# Altium project 1.1 - SYNC_BUCK_IR2104_2021.7.31.PrjPcb
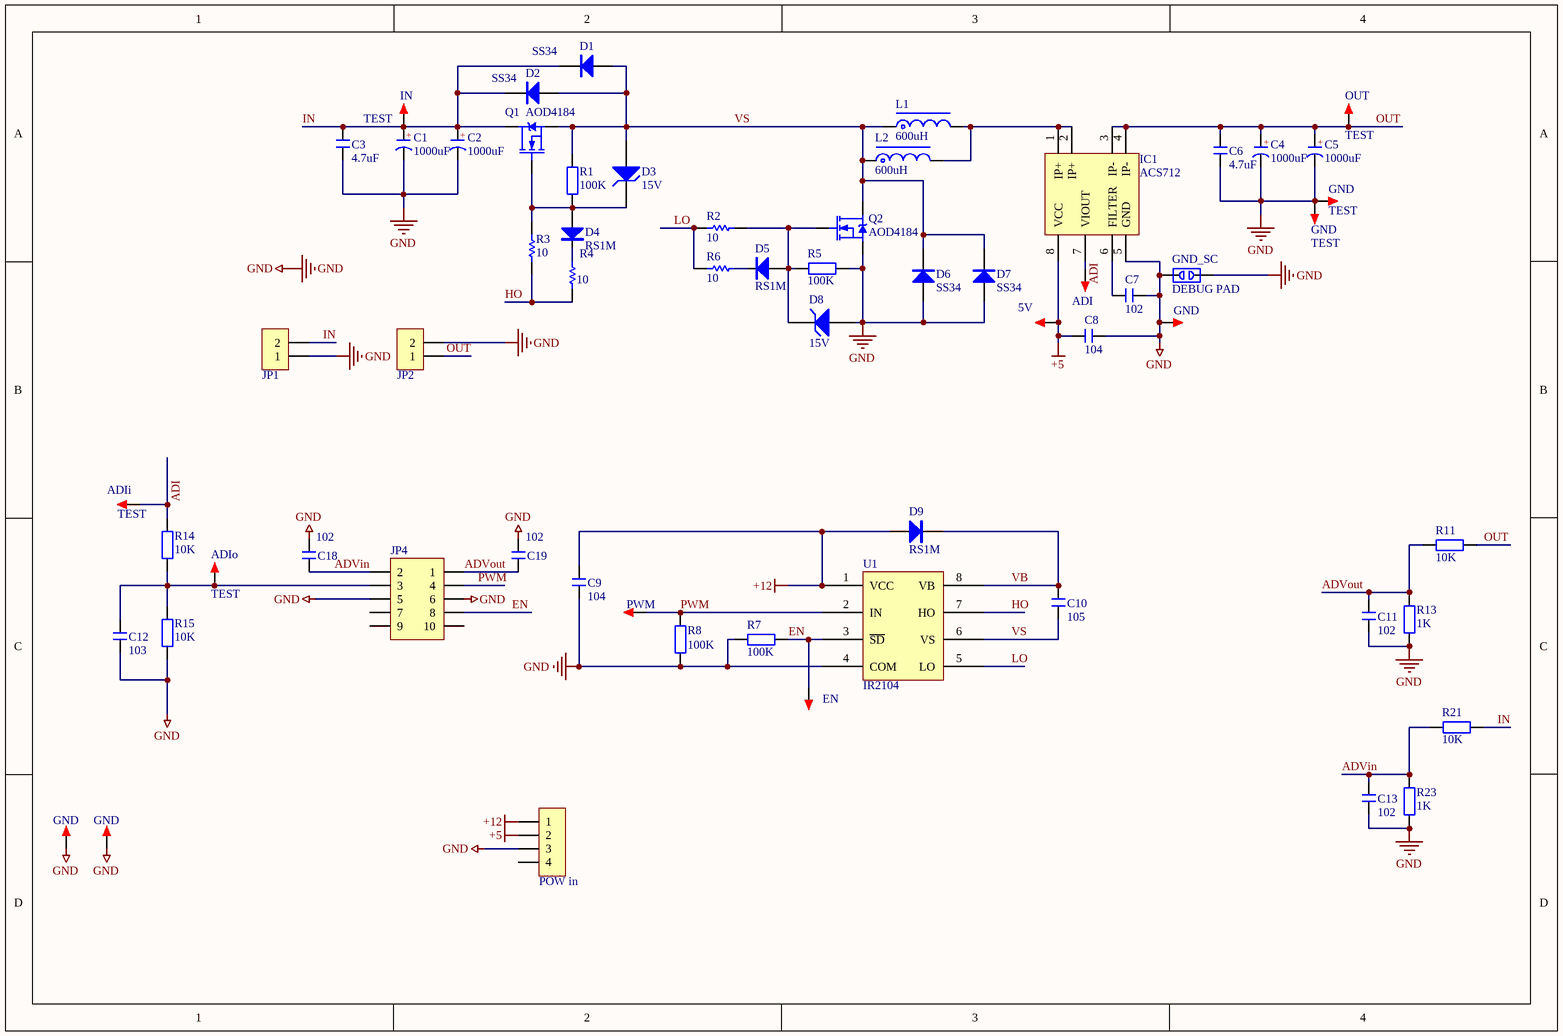
[diagram p0: IR2104_SYNC_BUCK.SchDoc]
1 sheet, 62 parts. Net scope: global (net labels, ports and power ports of the same name join across sheets).
Board file: IR2104_SYNC_BUCK.PcbDoc

## Sheet IR2104_SYNC_BUCK.SchDoc
size A4; Organization: Altium Limited; Address1: L3, 12a Rodborough Rd; Address2: Frenchs Forest; Address3: NSW; Address4: Australia 2086

### Parts
(Parts that share a designator on the sheet are numbered #1, #2 ... from top to bottom, then left to right.)
5V  TEST  [TEST 1.6]  (value not drawn)
ADI  TEST  [TEST 1.6]  (value not drawn)
ADIi  TEST  [TEST 1.6]
ADIo  TEST  [TEST 1.6]
C1  1000uF  [CAP 7.5*16*25]
C2  1000uF  [CAP 7.5*16*25]
C3  4.7uF  [CBB 25]
C4  1000uF  [CAP 7.5*16*25]
C5  1000uF  [CAP 7.5*16*25]
C6  4.7uF  [CBB 25]
C7  102  [C 0805_L]
C8  104  [C 0805_L]
C9  104  [C 0805_L]
C10  105  [C 0805_L]
C11  102  [C 0805_L]
C12  103  [C 0805_L]
C13  102  [C 0805_L]
C18  102  [C 0805_L]
C19  102  [C 0805_L]
D1  SS34  [SMC]
D2  SS34  [SMA]
D3  15V  [LL41]
D4  RS1M  [SMA]
D5  RS1M  [SMA]
D6  SS34  [SMA]
D7  SS34  [SMC]
D8  15V  [LL41]
D9  RS1M  [SMA]
EN  TEST  [TEST 1.2]  (value not drawn)
GND#1  TEST  [TEST 2.4]
GND#2  TEST  [TEST 2.4]
GND#3  TEST  [TEST 1.6]  (value not drawn)
GND#4  TEST TP  [TEST TP1.4_B]  (value not drawn)
GND#5  TEST TP  [TEST TP1.4_B]  (value not drawn)
GND_SC  DEBUG PAD  [DEBUG_B]
IC1  ACS712  [SOP8_N]
IN  TEST  [TEST 2.4]
JP1  HDR-1X2  [KF7620-2P]  (value not drawn)
JP2  HDR-1X2  [KF7620-2P]  (value not drawn)
JP4  Header 5X2  [IDC2.54-LI-2x5P]  (value not drawn)
L1  600uH  [CS400125]
L2  600uH  [CS270125]
OUT  TEST  [TEST 2.4]
POW_in  HDR-1X4  [KF2510-LI-4P]  (value not drawn)
PWM  TEST  [TEST 1.2]  (value not drawn)
Q1  AOD4184  [TO252]
Q2  AOD4184  [TO252]
R1  100K  [R 0805_L]
R2  10  [RS 1W-V5]
R3  10  [RS 1W-V5]
R4  10  [RS 1W-V5]
R5  100K  [R 0805_L]
R6  10  [RS 1W-V5]
R7  100K  [R 0805_L]
R8  100K  [R 0805_L]
R11  10K  [R 0805_L]
R13  1K  [R 0805_L]
R14  10K  [R 0805_L]
R15  10K  [R 0805_L]
R21  10K  [R 0805_L]
R23  1K  [R 0805_L]
U1  IR2104  [SOP8]

### Nets
+5: 5V.1 C8.2 IC1.8(VCC) POW_in.2
+12: C9.2 D9.1(A) POW_in.1 U1.1(VCC)
GND: C1.2(K) C2.2(K) C3.1 C4.2(K) C5.2(K) C6.1 C7.1 C8.1 C9.1 C11.1 C12.1 C13.1 C18.2 C19.2 D6.1(A) D7.1(A) D8.1(A) GND#1.1 GND#2.1 GND#3.1 GND#4.1 GND#5.1 GND_SC.1 GND_SC.2 IC1.5(GND) JP1.1 JP2.2 JP4.5 JP4.6 POW_in.3 Q2.3(S) R5.2 R7.2 R8.1 R13.1 R15.2 R23.1 U1.4(COM)
ADI: ADI.1 ADIi.1 IC1.7(VIOUT) R14.1
ADVin: C13.2 C18.1 JP4.2 R21.1 R23.2
ADVout: C11.2 C19.1 JP4.1 R11.1 R13.2
EN: EN.1 JP4.8 R7.1 U1.3(~{SD})
HO: R3.2 R4.1 U1.7(HO)
IN: C1.1(A) C2.1(A) C3.2 D1.2(K) D2.2(K) IN.1 JP1.2 Q1.2(D) R21.2
LO: R2.2 R6.1 U1.5(LO)
OUT: C4.1(A) C5.1(A) C6.2 IC1.3(IP-) IC1.4(IP-) JP2.1 OUT.1 R11.2
PWM: JP4.4 PWM.1 R8.2 U1.2(IN)
VB: C10.2 D9.2(K) U1.8(VB)
VS: C10.1 D1.1(A) D2.1(A) D3.1(A) D6.2(K) D7.2(K) L1.1 L2.1 Q1.3(S) Q2.2(D) R1.2 U1.6(VS)
NetADIo_1: ADIo.1 C12.2 JP4.3 R14.2 R15.1
NetC7_2: C7.2 IC1.6(FILTER)
NetD3_2: D3.2(K) D4.1(A) Q1.1(G) R1.1 R3.1
NetD4_2: D4.2(K) R4.2
NetD5_1: D5.1(A) D8.2(K) Q2.1(G) R2.1 R5.1
NetD5_2: D5.2(K) R6.2
NetIC1_1: IC1.1(IP+) IC1.2(IP+) L1.2 L2.2

Not connected (* = marked no-connect by the designer): JP4 7 9 10; POW_in 4

### Notes on the sheet
- Title
- Size:
- Date:
- A4
- Number:
- Time:
- Revision:
- Sheet
- of
- File:
- (in symbol CE) +

### Library data of the parts
5V ADI ADIi ADIo EN GND#1-GND#3 IN OUT PWM = TEST: 测试点; 淘宝ID: 小糖豆的小窝窝; BOM名称: 测试点; 下单链接: https://item.taobao.com/item.htm?ft=t&id=613637044352
C1 C2 C4 C5 = CE: 直插电解电容; 淘宝ID: 小糖豆的小窝窝; BOM名称: 直插电解电容; 下单链接: https://item.taobao.com/item.htm?ft=t&id=613637044352
C3 C6 = CBB: CBB电容; 淘宝ID: 小糖豆的小窝窝; BOM名称: CBB电容; 下单链接: https://item.taobao.com/item.htm?ft=t&id=613637044352
C7-C13 C18 C19 = C: 贴片电容; 淘宝ID: 小糖豆的小窝窝; BOM名称: 贴片电容; 下单链接: https://item.taobao.com/item.htm?ft=t&id=613637044352
D1 D2 D4-D7 D9 = 1N4007: 整流二极管; 淘宝ID: 小糖豆的小窝窝; BOM名称: 整流二极管; 下单链接: https://item.taobao.com/item.htm?ft=t&id=613637044352
D3 D8 = D Zener: Zener Diode; Published: 8-Jun-2000; LatestRevisionDate: 17-Jul-2002; LatestRevisionNote: Re-released for DXP Platform.; PackageReference: DIODE-0.7; Publisher: Altium Limited; PackageDescription: Diode, Thru-Hole; 2 Leads; 0.7 in Pin Spacing
GND#4 GND#5 = TEST TP: 测试环; 淘宝ID: 小糖豆的小窝窝; BOM名称: 测试环; 下单链接: https://item.taobao.com/item.htm?ft=t&id=613637044352
GND_SC = DEBUG: 调试断点焊盘; 淘宝ID: 小糖豆的小窝窝; BOM名称: 调试断点焊盘; 下单链接: https://item.taobao.com/item.htm?ft=t&id=613637044352
IC1 = ACS712: 电流检测芯片; 淘宝ID: 小糖豆的小窝窝; BOM名称: 电流检测芯片; Alias1: https://item.taobao.com/item.htm?ft=t&id=613637044352
JP1 JP2 = Header 2: 2P接插件; 淘宝ID: 小糖豆的小窝窝; BOM名称: 2P接插件; 下单链接: https://item.taobao.com/item.htm?ft=t&id=613637044352
JP4 = Header 5X2: 5*2P接插件; 淘宝ID: 小糖豆的小窝窝; BOM名称: 5*2P接插件; 下单链接: https://item.taobao.com/item.htm?ft=t&id=613637044352
L1 L2 = L-MR: 功率磁环电感; 淘宝ID: 小糖豆的小窝窝; BOM名称: 功率磁环电感; 下单链接: https://item.taobao.com/item.htm?ft=t&id=613637044352
POW_in = Header 4: 4P接插件; 淘宝ID: 小糖豆的小窝窝; BOM名称: 4P接插件; 下单链接: https://item.taobao.com/item.htm?ft=t&id=613637044352
Q1 Q2 = IRF3710: N沟场效应管; 淘宝ID: 小糖豆的小窝窝; BOM名称: N沟场效应管; 下单链接: https://item.taobao.com/item.htm?ft=t&id=613637044352
R1 R5 R7 R8 R11 R13-R15 R21 R23 = R: 贴片电阻; 淘宝ID: 小糖豆的小窝窝; BOM名称: 贴片电阻; 下单链接: https://item.taobao.com/item.htm?ft=t&id=613637044352
R2-R4 R6 = Res: 色环电阻; 淘宝ID: 小糖豆的小窝窝; BOM名称: 色环电阻; 下单链接: https://item.taobao.com/item.htm?ft=t&id=613637044352